# EAGLE schematic OLED_I2C_NANO (EAGLE 9.6.2)
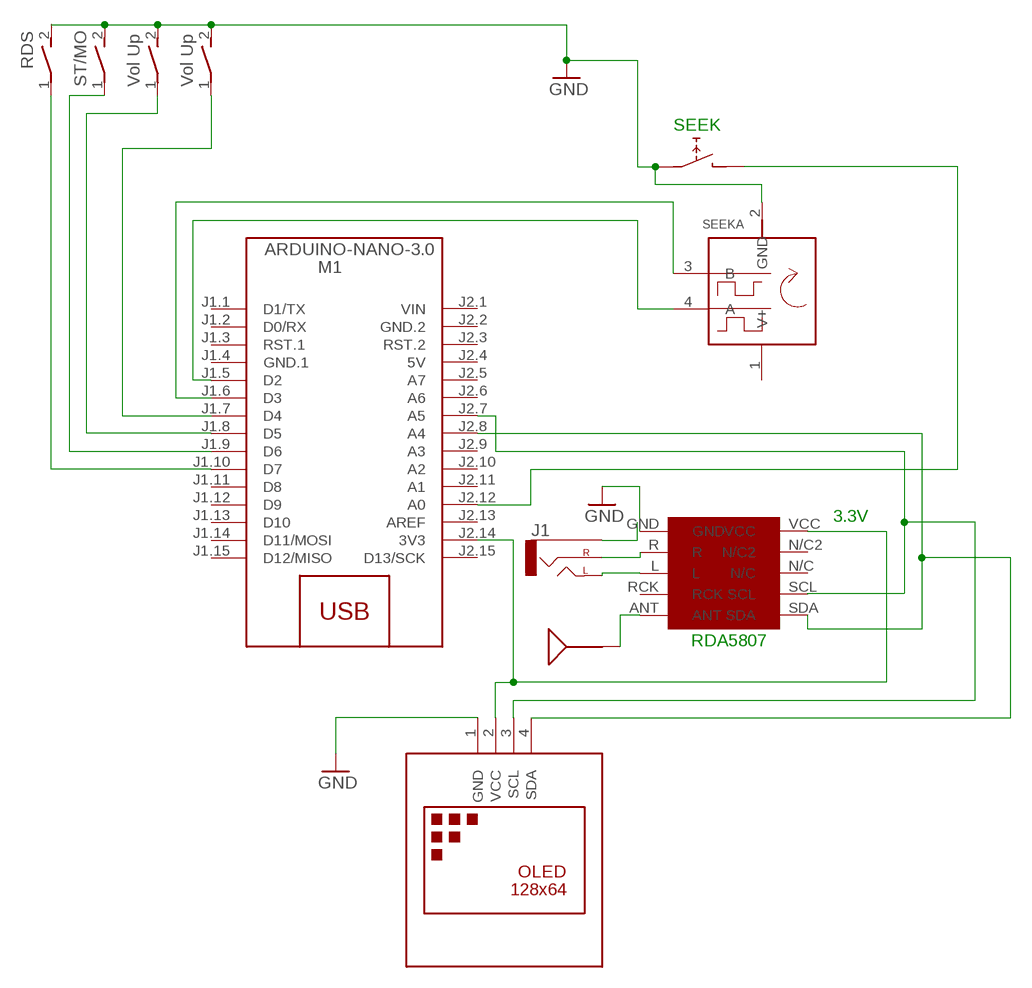
[diagram p0: schematic, sheet 1]

## Parts
A1  ANTENNA-2.4GHZ-3.2X1.6MM  [ANT-2.4GHZ-3.2X1.6X1.2MM]
J1  AUDIO_JACK_2.5MM_2.5MM  [STEREOJACK2.5MM_STEREOJACK2.5MM]
M1  ARDUINO-NANO-3.0  [ARDUINO-NANO-3.0]
S1  Vol Up  DS01E  [DS-01]
S4  Vol Up  DS01E  [DS-01]
S5  ST/MO  DS01E  [DS-01]
S6  RDS  DS01E  [DS-01]
SEEK  62P16-HX  [62P]
U$1  RDA  [RDA]
U$2  DISPLAY-OLED-128X64-I2C  [DISPLAY-OLED-128X64-I2C]

## Nets
GND: S1.2 S4.2 S5.2 S6.2 SEEK.2(A:GND) SEEK.5(SW:D) U$1.GND U$2.1(GND)
N$6: M1.J1.5(D2) SEEK.4(A:A)
N$7: M1.J2.14(3V3) U$1.VCC U$2.2(VCC)
N$8: M1.J2.8(A4) U$1.SDA U$2.4(SDA)
N$9: M1.J2.7(A5) U$1.SCL U$2.3(SCL)
N$10: M1.J1.6(D3) SEEK.3(A:B)
N$11: A1.FEED(SIGNAL) U$1.ANT
N$12: J1.RING1(SLEEVE)
N$13: J1.TIP(RIGHT) U$1.R
N$14: J1.SHIELD(LEFT) U$1.L
N$15: M1.J1.10(D7) S6.1
N$16: M1.J1.9(D6) S5.1
N$17: M1.J1.8(D5) S4.1
N$18: M1.J1.7(D4) S1.1
N$28: M1.J2.12(A0) SEEK.6(SW:E)
Unconnected: M1.J1.1(D1/TX) M1.J1.2(D0/RX) M1.J1.3(RST.1) M1.J1.11(D8) M1.J1.12(D9) M1.J1.13(D10) M1.J1.14(D11/MOSI) M1.J1.15(D12/MISO) M1.J2.3(RST.2) M1.J2.5(A7) M1.J2.6(A6) M1.J2.9(A3) M1.J2.10(A2) M1.J2.11(A1) M1.J2.13(AREF) M1.J2.15(D13/SCK) SEEK.1(A:V+) U$1.N/C U$1.N/C2 U$1.RCK

## Notes on the sheet
- SEEK
- 3.3V
- RDA5807

## Power pins joined to a net without a drawn wire
5V: M1.J2.4(5V)
GND.1: M1.J1.4(GND.1)
GND.2: M1.J2.2(GND.2)
VIN: M1.J2.1(VIN)

## Library data of the parts
A1 = SparkFun-RF:ANTENNA: Single-ended Antennae 2.4GHz and antennae with just one terminal. These are all chip antennae. 2.4GHz (WiFi/BT/ZigBee) Antennae ANT-2.4GHZ-6.5X2.2MM - 6.5 x 2.2 mm chip antenna. (SparkFun Product <https://www.sparkfun.com/products/144>) ANT-2.4GHZ8.0X1.0MM - 8.0 x 1.0 mm chip antenna. (Datasheet <http://www.mouser.com/ds/2/611/antenna_2500at44m0400-242425.pdf>) ANT-2.4GHZ9.5X2.0MM - 9.5 x 2.0 mm chip antenna. (SparkFun Product <https://www.sparkfun.com/products/9025>); PROD_ID: ANT-14235
J1 = SparkFun-Connectors:AUDIO_JACK_2.5MM: Audio Jack 2.5mm variants of PTH and SMT audio jacks. SparkFun Products: SparkFun PicoBoard <https://www.sparkfun.com/products/11888>- 2.5mm SMD; PROD_ID: CONN-09878
M1 = diy-modules:ARDUINO-NANO-3.0: Arduino Nano 3.0 and compatible devices More details available here: https://www.arduino.cc/en/Main/ArduinoBoardNano Click here to find device on ebay.com <http://www.ebay.com/sch/arduino+nano>
S1 S4-S6 = switch-dil:DS01E: DIL/CODE SWITCH; OC_FARNELL: unknown; OC_NEWARK: unknown
SEEK = rotary-encoder:62P*X
U$1 = RDA:RDA
U$2 = diy-modules:DISPLAY-OLED-128X64-I2C: 128x64 Dot Matrix OLED Module based on SSD1306 chip Variant with I2C interface More details available here: http://www.instructables.com/id/Monochrome-096-i2c-OLED-display-with-arduino-SSD13/ SSD1306 datasheet: https://cdn-shop.adafruit.com/datasheets/SSD1306.pdf Click here to find device on ebay.com <http://www.ebay.com/sch/oled+display+128x64+iic> Note: There are two variants: I2C and SPI. Search for the proper version.